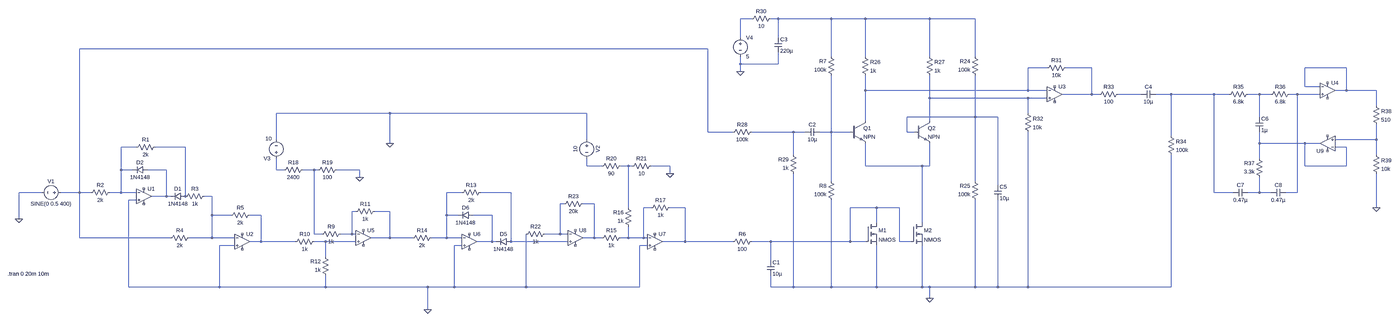
[diagram p0: schematic Draft5.asc, whole sheet]
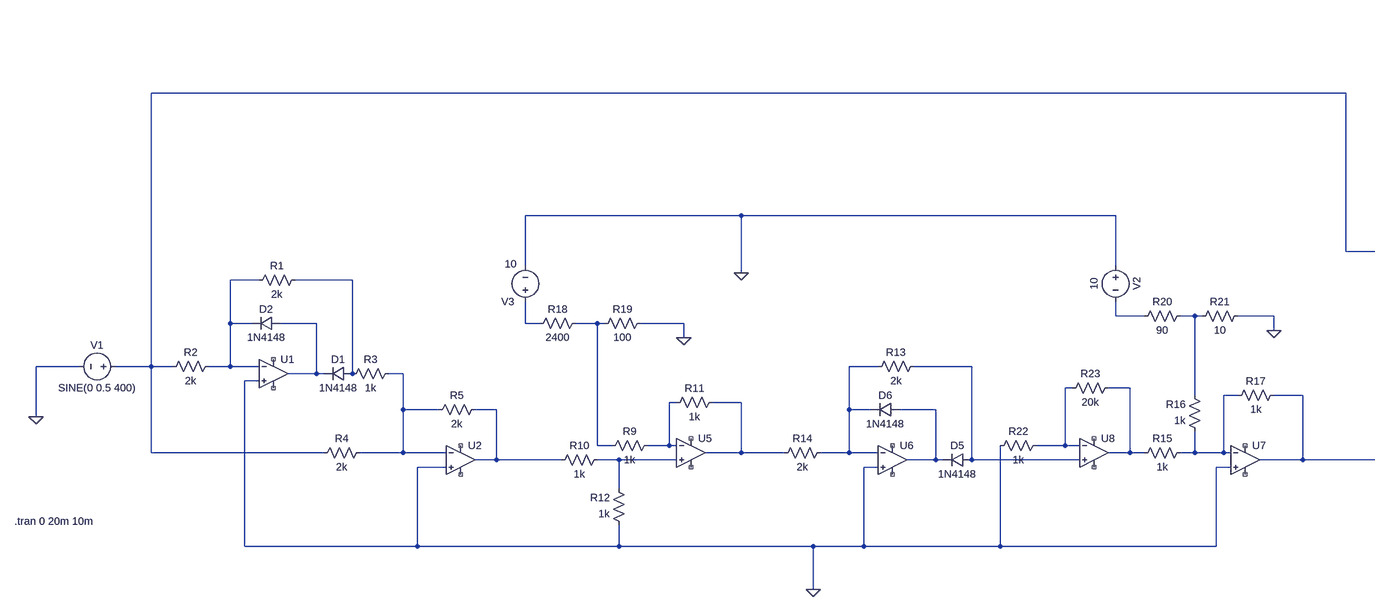
[diagram p1: schematic Draft5.asc, part, row 1 of 1, column 1 of 2]
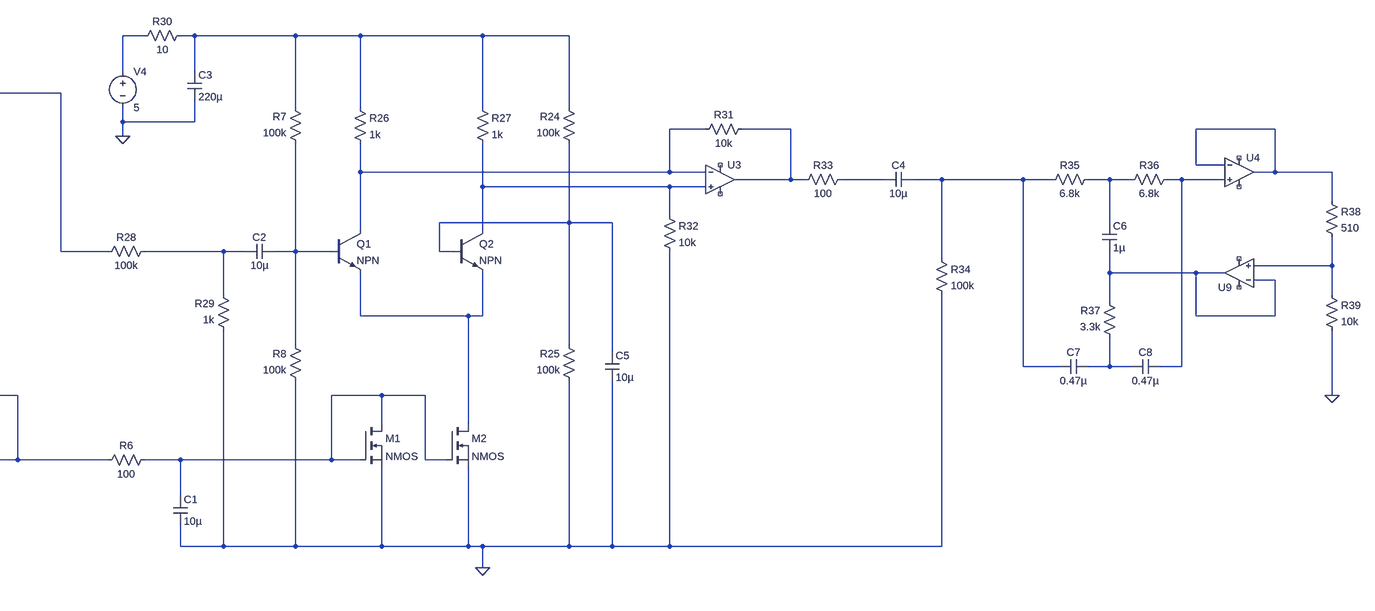
[diagram p2: schematic Draft5.asc, part, row 1 of 1, column 2 of 2]
Draft5.asc, the LTspice schematic file:
Version 4
SHEET 1 6760 1060
WIRE 2672 -592 2624 -592
WIRE 2784 -592 2752 -592
WIRE 3008 -592 2784 -592
WIRE 3152 -592 3008 -592
WIRE 3424 -592 3152 -592
WIRE 3616 -592 3424 -592
WIRE 2624 -512 2624 -592
WIRE 2784 -512 2784 -592
WIRE 2368 -464 -288 -464
WIRE 3008 -432 3008 -592
WIRE 3152 -432 3152 -592
WIRE 3424 -432 3424 -592
WIRE 3616 -432 3616 -592
WIRE 2624 -400 2624 -432
WIRE 2784 -400 2784 -448
WIRE 2784 -400 2624 -400
WIRE 3920 -384 3840 -384
WIRE 4112 -384 4000 -384
WIRE 5264 -384 5088 -384
WIRE 2624 -368 2624 -400
WIRE 5088 -304 5088 -384
WIRE 5152 -304 5088 -304
WIRE 3152 -288 3152 -352
WIRE 3840 -288 3840 -384
WIRE 3840 -288 3152 -288
WIRE 3920 -288 3840 -288
WIRE 5264 -288 5264 -384
WIRE 5264 -288 5216 -288
WIRE 5392 -288 5264 -288
WIRE 4112 -272 4112 -384
WIRE 4112 -272 3984 -272
WIRE 4144 -272 4112 -272
WIRE 4320 -272 4224 -272
WIRE 4448 -272 4384 -272
WIRE 4704 -272 4448 -272
WIRE 4768 -272 4704 -272
WIRE 4896 -272 4848 -272
WIRE 4944 -272 4896 -272
WIRE 5056 -272 5024 -272
WIRE 5152 -272 5056 -272
WIRE 3424 -256 3424 -352
WIRE 3840 -256 3424 -256
WIRE 3920 -256 3840 -256
WIRE 5392 -224 5392 -288
WIRE 1024 -192 544 -192
WIRE 1856 -192 1024 -192
WIRE 3840 -192 3840 -256
WIRE 3616 -176 3616 -352
WIRE 3616 -176 3328 -176
WIRE 3712 -176 3616 -176
WIRE 4896 -176 4896 -272
WIRE 3152 -160 3152 -288
WIRE 3424 -160 3424 -256
WIRE 2368 -112 2368 -464
WIRE 2592 -112 2368 -112
WIRE 2848 -112 2672 -112
WIRE 2896 -112 2848 -112
WIRE 3008 -112 3008 -352
WIRE 3008 -112 2960 -112
WIRE 3088 -112 3008 -112
WIRE 3328 -112 3328 -176
WIRE 3360 -112 3328 -112
WIRE 4448 -96 4448 -272
WIRE 544 -80 544 -192
WIRE 1856 -80 1856 -192
WIRE 5392 -80 5392 -144
WIRE 5392 -80 5216 -80
WIRE 1024 -64 1024 -192
WIRE 4896 -64 4896 -112
WIRE 5088 -64 4896 -64
WIRE 5152 -64 5088 -64
WIRE -48 -48 -112 -48
WIRE 160 -48 32 -48
WIRE 5264 -48 5216 -48
WIRE 2848 -16 2848 -112
WIRE 5392 -16 5392 -80
WIRE 4896 0 4896 -64
WIRE 1856 32 1856 0
WIRE 1920 32 1856 32
WIRE 2032 32 2000 32
WIRE 2048 32 2032 32
WIRE 2208 32 2128 32
WIRE 3152 32 3152 -64
WIRE 3392 32 3152 32
WIRE 3424 32 3424 -64
WIRE 3424 32 3392 32
WIRE 5088 32 5088 -64
WIRE 5264 32 5264 -48
WIRE 5264 32 5088 32
WIRE -112 48 -112 -48
WIRE -64 48 -112 48
WIRE 80 48 0 48
WIRE 544 48 544 0
WIRE 576 48 544 48
WIRE 704 48 656 48
WIRE 720 48 704 48
WIRE 896 48 800 48
WIRE 2208 64 2208 32
WIRE 896 80 896 48
WIRE 3008 96 3008 -112
WIRE 3616 96 3616 -176
WIRE 3712 112 3712 -176
WIRE -448 144 -544 144
WIRE -288 144 -288 -464
WIRE -288 144 -368 144
WIRE -240 144 -288 144
WIRE -112 144 -112 48
WIRE -112 144 -160 144
WIRE -48 144 -112 144
WIRE 1328 144 1264 144
WIRE 1536 144 1408 144
WIRE 4704 144 4704 -272
WIRE 4784 144 4704 144
WIRE 4896 144 4896 80
WIRE 4896 144 4848 144
WIRE 4944 144 4896 144
WIRE 5056 144 5056 -272
WIRE 5056 144 5008 144
WIRE 80 160 80 48
WIRE 80 160 16 160
WIRE 96 160 80 160
WIRE 160 160 160 -48
WIRE 272 160 240 160
WIRE -48 176 -80 176
WIRE 1760 192 1744 192
WIRE 1888 192 1840 192
WIRE 2032 208 2032 32
WIRE 2128 208 2096 208
WIRE 2272 208 2208 208
WIRE 3200 208 3088 208
WIRE 3296 208 3200 208
WIRE 5392 208 5392 64
WIRE 880 224 864 224
WIRE 1024 224 960 224
WIRE 272 240 272 160
WIRE 352 240 272 240
WIRE 480 240 432 240
WIRE 1264 240 1264 144
WIRE 1312 240 1264 240
WIRE 1456 240 1376 240
WIRE -544 256 -544 144
WIRE 3200 272 3200 208
WIRE 3392 272 3392 32
WIRE 704 320 704 48
WIRE 736 320 704 320
WIRE 864 320 864 224
WIRE 864 320 816 320
WIRE 880 320 864 320
WIRE 1744 320 1744 192
WIRE 1744 320 1680 320
WIRE 1776 320 1744 320
WIRE -288 336 -288 144
WIRE 96 336 -288 336
WIRE 272 336 272 240
WIRE 272 336 176 336
WIRE 368 336 272 336
WIRE 1024 336 1024 224
WIRE 1024 336 944 336
WIRE 1120 336 1024 336
WIRE 1264 336 1264 240
WIRE 1264 336 1200 336
WIRE 1328 336 1264 336
WIRE 1888 336 1888 192
WIRE 1888 336 1840 336
WIRE 1920 336 1888 336
WIRE 2032 336 2032 288
WIRE 2032 336 2000 336
WIRE 2096 336 2096 208
WIRE 2096 336 2032 336
WIRE 2112 336 2096 336
WIRE 480 352 480 240
WIRE 480 352 432 352
WIRE 624 352 480 352
WIRE 752 352 704 352
WIRE 880 352 752 352
WIRE 1456 352 1456 240
WIRE 1456 352 1392 352
WIRE 1472 352 1456 352
WIRE 1536 352 1536 144
WIRE 1776 352 1536 352
WIRE 2272 352 2272 208
WIRE 2272 352 2176 352
WIRE 2592 352 2272 352
WIRE 2752 352 2672 352
WIRE 3088 352 3088 208
WIRE 3088 352 2752 352
WIRE 3152 352 3088 352
WIRE 3296 352 3296 208
WIRE 3344 352 3296 352
WIRE 368 368 304 368
WIRE 1328 368 1296 368
WIRE 2112 368 2080 368
WIRE 752 416 752 352
WIRE 2752 432 2752 352
WIRE -80 544 -80 176
WIRE 304 544 304 368
WIRE 304 544 -80 544
WIRE 752 544 752 496
WIRE 752 544 304 544
WIRE 1184 544 752 544
WIRE 1296 544 1296 368
WIRE 1296 544 1184 544
WIRE 1600 544 1600 320
WIRE 1600 544 1296 544
WIRE 2080 544 2080 368
WIRE 2080 544 1600 544
WIRE 2752 544 2752 496
WIRE 2848 544 2848 64
WIRE 2848 544 2752 544
WIRE 3008 544 3008 176
WIRE 3008 544 2848 544
WIRE 3200 544 3200 368
WIRE 3200 544 3008 544
WIRE 3392 544 3392 368
WIRE 3392 544 3200 544
WIRE 3424 544 3392 544
WIRE 3616 544 3616 176
WIRE 3616 544 3424 544
WIRE 3712 544 3712 176
WIRE 3712 544 3616 544
WIRE 3840 544 3840 -112
WIRE 3840 544 3712 544
WIRE 4448 544 4448 -16
WIRE 4448 544 3840 544
WIRE 3424 592 3424 544
WIRE 1184 640 1184 544
FLAG -544 256 0
FLAG 896 80 0
FLAG 2208 64 0
FLAG 1024 -64 0
FLAG 3424 592 0
FLAG 2624 -368 0
FLAG 1184 640 0
FLAG 5392 208 0
SYMBOL OpAmps\\UniversalOpAmp -16 160 R0
SYMATTR InstName U1
SYMBOL OpAmps\\UniversalOpAmp 400 352 R0
SYMATTR InstName U2
SYMBOL res 48 -64 R90
WINDOW 0 0 56 VBottom 2
WINDOW 3 32 56 VTop 2
SYMATTR InstName R1
SYMATTR Value 2k
SYMBOL res -144 128 R90
WINDOW 0 0 56 VBottom 2
WINDOW 3 32 56 VTop 2
SYMATTR InstName R2
SYMATTR Value 2k
SYMBOL res 256 144 R90
WINDOW 0 0 56 VBottom 2
WINDOW 3 32 56 VTop 2
SYMATTR InstName R3
SYMATTR Value 1k
SYMBOL res 192 320 R90
WINDOW 0 0 56 VBottom 2
WINDOW 3 32 56 VTop 2
SYMATTR InstName R4
SYMATTR Value 2k
SYMBOL res 448 224 R90
WINDOW 0 0 56 VBottom 2
WINDOW 3 32 56 VTop 2
SYMATTR InstName R5
SYMATTR Value 2k
SYMBOL diode 160 144 R90
WINDOW 0 0 32 VBottom 2
WINDOW 3 32 32 VTop 2
SYMATTR InstName D1
SYMATTR Value 1N4148
SYMBOL diode 0 32 R90
WINDOW 0 0 32 VBottom 2
WINDOW 3 32 32 VTop 2
SYMATTR InstName D2
SYMATTR Value 1N4148
SYMBOL voltage -352 144 R90
WINDOW 0 -32 56 VBottom 2
WINDOW 3 32 56 VTop 2
WINDOW 123 0 0 Left 0
WINDOW 39 0 0 Left 0
SYMATTR InstName V1
SYMATTR Value SINE(0 0.5 400)
SYMBOL voltage 1856 -96 R0
WINDOW 0 32 56 VTop 2
WINDOW 3 -32 56 VBottom 2
WINDOW 123 0 0 Left 0
WINDOW 39 0 0 Left 0
SYMATTR InstName V2
SYMATTR Value 10
SYMBOL voltage 544 16 R180
WINDOW 123 0 0 Left 0
WINDOW 39 0 0 Left 0
WINDOW 3 19 100 Left 2
SYMATTR Value 10
SYMATTR InstName V3
SYMBOL OpAmps\\UniversalOpAmp 912 336 R0
SYMATTR InstName U5
SYMBOL res 832 304 R90
WINDOW 0 0 56 VBottom 2
WINDOW 3 32 56 VTop 2
SYMATTR InstName R9
SYMATTR Value 1k
SYMBOL res 720 336 R90
WINDOW 0 0 56 VBottom 2
WINDOW 3 32 56 VTop 2
SYMATTR InstName R10
SYMATTR Value 1k
SYMBOL res 976 208 R90
WINDOW 0 0 56 VBottom 2
WINDOW 3 32 56 VTop 2
SYMATTR InstName R11
SYMATTR Value 1k
SYMBOL res 768 512 R180
WINDOW 0 36 76 Left 2
WINDOW 3 36 40 Left 2
SYMATTR InstName R12
SYMATTR Value 1k
SYMBOL OpAmps\\UniversalOpAmp 1360 352 R0
SYMATTR InstName U6
SYMBOL res 1424 128 R90
WINDOW 0 0 56 VBottom 2
WINDOW 3 32 56 VTop 2
SYMATTR InstName R13
SYMATTR Value 2k
SYMBOL res 1216 320 R90
WINDOW 0 0 56 VBottom 2
WINDOW 3 32 56 VTop 2
SYMATTR InstName R14
SYMATTR Value 2k
SYMBOL diode 1536 336 R90
WINDOW 0 0 32 VBottom 2
WINDOW 3 32 32 VTop 2
SYMATTR InstName D5
SYMATTR Value 1N4148
SYMBOL diode 1376 224 R90
WINDOW 0 0 32 VBottom 2
WINDOW 3 32 32 VTop 2
SYMATTR InstName D6
SYMATTR Value 1N4148
SYMBOL OpAmps\\UniversalOpAmp 2144 352 R0
SYMATTR InstName U7
SYMBOL res 2016 320 R90
WINDOW 0 0 56 VBottom 2
WINDOW 3 32 56 VTop 2
SYMATTR InstName R15
SYMATTR Value 1k
SYMBOL res 2048 304 R180
WINDOW 0 36 76 Left 2
WINDOW 3 36 40 Left 2
SYMATTR InstName R16
SYMATTR Value 1k
SYMBOL res 2112 224 R270
WINDOW 0 32 56 VTop 2
WINDOW 3 0 56 VBottom 2
SYMATTR InstName R17
SYMATTR Value 1k
SYMBOL res 672 32 R90
WINDOW 0 0 56 VBottom 2
WINDOW 3 32 56 VTop 2
SYMATTR InstName R18
SYMATTR Value 2400
SYMBOL res 816 32 R90
WINDOW 0 0 56 VBottom 2
WINDOW 3 32 56 VTop 2
SYMATTR InstName R19
SYMATTR Value 100
SYMBOL res 2016 16 R90
WINDOW 0 0 56 VBottom 2
WINDOW 3 32 56 VTop 2
SYMATTR InstName R20
SYMATTR Value 90
SYMBOL res 2144 16 R90
WINDOW 0 0 56 VBottom 2
WINDOW 3 32 56 VTop 2
SYMATTR InstName R21
SYMATTR Value 10
SYMBOL OpAmps\\UniversalOpAmp 1808 336 R0
SYMATTR InstName U8
SYMBOL res 1696 304 R90
WINDOW 0 0 56 VBottom 2
WINDOW 3 32 56 VTop 2
SYMATTR InstName R22
SYMATTR Value 1k
SYMBOL res 1856 176 R90
WINDOW 0 0 56 VBottom 2
WINDOW 3 32 56 VTop 2
SYMATTR InstName R23
SYMATTR Value 20k
SYMBOL npn 3088 -160 R0
SYMATTR InstName Q1
SYMBOL npn 3360 -160 R0
SYMATTR InstName Q2
SYMBOL cap 2736 432 R0
SYMATTR InstName C1
SYMATTR Value 10µ
SYMBOL res 2688 336 R90
WINDOW 0 0 56 VBottom 2
WINDOW 3 32 56 VTop 2
SYMATTR InstName R6
SYMATTR Value 100
SYMBOL res 3024 -336 R180
WINDOW 0 36 76 Left 2
WINDOW 3 36 40 Left 2
SYMATTR InstName R7
SYMATTR Value 100k
SYMBOL res 3024 192 R180
WINDOW 0 36 76 Left 2
WINDOW 3 36 40 Left 2
SYMATTR InstName R8
SYMATTR Value 100k
SYMBOL res 3632 -336 R180
WINDOW 0 36 76 Left 2
WINDOW 3 36 40 Left 2
SYMATTR InstName R24
SYMATTR Value 100k
SYMBOL res 3632 192 R180
WINDOW 0 36 76 Left 2
WINDOW 3 36 40 Left 2
SYMATTR InstName R25
SYMATTR Value 100k
SYMBOL res 3136 -448 R0
SYMATTR InstName R26
SYMATTR Value 1k
SYMBOL res 3408 -448 R0
SYMATTR InstName R27
SYMATTR Value 1k
SYMBOL voltage 2624 -528 R0
SYMATTR InstName V4
SYMATTR Value 5
SYMBOL res 2688 -128 R90
WINDOW 0 0 56 VBottom 2
WINDOW 3 32 56 VTop 2
SYMATTR InstName R28
SYMATTR Value 100k
SYMBOL res 2864 80 R180
WINDOW 0 36 76 Left 2
WINDOW 3 36 40 Left 2
SYMATTR InstName R29
SYMATTR Value 1k
SYMBOL cap 2960 -128 R90
WINDOW 0 0 32 VBottom 2
WINDOW 3 32 32 VTop 2
SYMATTR InstName C2
SYMATTR Value 10µ
SYMBOL cap 2768 -512 R0
SYMATTR InstName C3
SYMATTR Value 220µ
SYMBOL res 2768 -608 R90
WINDOW 0 0 56 VBottom 2
WINDOW 3 32 56 VTop 2
SYMATTR InstName R30
SYMATTR Value 10
SYMBOL OpAmps\\UniversalOpAmp 3952 -272 R0
SYMATTR InstName U3
SYMBOL res 4016 -400 R90
WINDOW 0 0 56 VBottom 2
WINDOW 3 32 56 VTop 2
SYMATTR InstName R31
SYMATTR Value 10k
SYMBOL res 3824 -208 R0
SYMATTR InstName R32
SYMATTR Value 10k
SYMBOL res 4240 -288 R90
WINDOW 0 0 56 VBottom 2
WINDOW 3 32 56 VTop 2
SYMATTR InstName R33
SYMATTR Value 100
SYMBOL cap 4384 -288 R90
WINDOW 0 0 32 VBottom 2
WINDOW 3 32 32 VTop 2
SYMATTR InstName C4
SYMATTR Value 10µ
SYMBOL res 4432 -112 R0
SYMATTR InstName R34
SYMATTR Value 100k
SYMBOL cap 3696 112 R0
SYMATTR InstName C5
SYMATTR Value 10µ
SYMBOL nmos 3152 272 R0
SYMATTR InstName M1
SYMBOL nmos 3344 272 R0
SYMATTR InstName M2
SYMBOL res 4864 -288 R90
WINDOW 0 0 56 VBottom 2
WINDOW 3 32 56 VTop 2
SYMATTR InstName R35
SYMATTR Value 6.8k
SYMBOL res 5040 -288 R90
WINDOW 0 0 56 VBottom 2
WINDOW 3 32 56 VTop 2
SYMATTR InstName R36
SYMATTR Value 6.8k
SYMBOL res 4912 96 R180
WINDOW 0 36 76 Left 2
WINDOW 3 36 40 Left 2
SYMATTR InstName R37
SYMATTR Value 3.3k
SYMBOL cap 4880 -176 R0
SYMATTR InstName C6
SYMATTR Value 1µ
SYMBOL cap 4848 128 R90
WINDOW 0 0 32 VBottom 2
WINDOW 3 32 32 VTop 2
SYMATTR InstName C7
SYMATTR Value 0.47µ
SYMBOL cap 5008 128 R90
WINDOW 0 0 32 VBottom 2
WINDOW 3 32 32 VTop 2
SYMATTR InstName C8
SYMATTR Value 0.47µ
SYMBOL OpAmps\\UniversalOpAmp 5184 -288 R0
SYMATTR InstName U4
SYMBOL OpAmps\\UniversalOpAmp 5184 -64 R180
SYMATTR InstName U9
SYMBOL res 5376 -240 R0
SYMATTR InstName R38
SYMATTR Value 510
SYMBOL res 5376 -32 R0
SYMATTR InstName R39
SYMATTR Value 10k
TEXT -592 488 Left 2 !.tran 0 20m 10m

The netlist it stands for:
* Draft5.asc
XU1 0 N017 NC_01 NC_02 N022 level1 Avol=1Meg GBW=10Meg Vos=0 En=0 Enk=0 In=0 Ink=0 Rin=500Meg  ; pins In+ In- V+ V- OUT
XU2 0 N028 NC_03 NC_04 N036 level1 Avol=1Meg GBW=10Meg Vos=0 En=0 Enk=0 In=0 Ink=0 Rin=500Meg  ; pins In+ In- V+ V- OUT
R1 N018 N017 2k
R2 N017 N003 2k
R3 N028 N018 1k
R4 N028 N003 2k
R5 N036 N028 2k
D1 N018 N022 1N4148
D2 N022 N017 1N4148
V1 N003 0 SINE(0 0.5 400)
V2 0 N019 10
V3 N023 0 10
XU5 N038 N034 NC_05 NC_06 N035 level1 Avol=1Meg GBW=10Meg Vos=0 En=0 Enk=0 In=0 Ink=0 Rin=500Meg  ; pins In+ In- V+ V- OUT
R9 N034 N024 1k
R10 N038 N036 1k
R11 N035 N034 1k
R12 0 N038 1k
XU6 0 N025 NC_07 NC_08 N037 level1 Avol=1Meg GBW=10Meg Vos=0 En=0 Enk=0 In=0 Ink=0 Rin=500Meg  ; pins In+ In- V+ V- OUT
R13 N026 N025 2k
R14 N025 N035 2k
D5 N026 N037 1N4148
D6 N037 N025 1N4148
XU7 0 N031 NC_09 NC_10 N032 level1 Avol=1Meg GBW=10Meg Vos=0 En=0 Enk=0 In=0 Ink=0 Rin=500Meg  ; pins In+ In- V+ V- OUT
R15 N031 N030 1k
R16 N031 N020 1k
R17 N031 N032 1k
R18 N024 N023 2400
R19 0 N024 100
R20 N020 N019 90
R21 0 N020 10
XU8 N026 N029 NC_11 NC_12 N030 level1 Avol=1Meg GBW=10Meg Vos=0 En=0 Enk=0 In=0 Ink=0 Rin=500Meg  ; pins In+ In- V+ V- OUT
R22 N029 0 1k
R23 N030 N029 20k
Q1 N004 N014 N021 0 NPN
Q2 N011 N012 N021 0 NPN
C1 N033 0 10µ
R6 N033 N032 100
R7 N014 N002 100k
R8 0 N014 100k
R24 N012 N002 100k
R25 0 N012 100k
R26 N002 N004 1k
R27 N002 N011 1k
V4 N001 0 5
R28 N013 N003 100k
R29 0 N013 1k
C2 N014 N013 10µ
C3 N002 0 220µ
R30 N002 N001 10
XU3 N011 N004 NC_13 NC_14 N005 level1 Avol=1Meg GBW=10Meg Vos=0 En=0 Enk=0 In=0 Ink=0 Rin=500Meg  ; pins In+ In- V+ V- OUT
R31 N005 N004 10k
R32 N011 0 10k
R33 N007 N005 100
C4 N008 N007 10µ
R34 N008 0 100k
C5 N012 0 10µ
M1 N033 N033 0 0 NMOS
M2 N021 N033 0 0 NMOS
R35 N009 N008 6.8k
R36 N010 N009 6.8k
R37 N027 N016 3.3k
C6 N009 N016 1µ
C7 N027 N008 0.47µ
C8 N010 N027 0.47µ
XU4 N010 N006 NC_15 NC_16 N006 level1 Avol=1Meg GBW=10Meg Vos=0 En=0 Enk=0 In=0 Ink=0 Rin=500Meg  ; pins In+ In- V+ V- OUT
XU9 N015 N016 NC_17 NC_18 N016 level1 Avol=1Meg GBW=10Meg Vos=0 En=0 Enk=0 In=0 Ink=0 Rin=500Meg  ; pins In+ In- V+ V- OUT
R38 N006 N015 510
R39 N015 0 10k
.model D D
.lib standard.dio
.model NPN NPN
.model PNP PNP
.lib standard.bjt
.model NMOS NMOS
.model PMOS PMOS
.lib standard.mos
.tran 0 20m 10m
.lib UniversalOpAmp1.lib
.backanno
.end